# Altium schematic sheet Sheet2.SchDoc
size A4
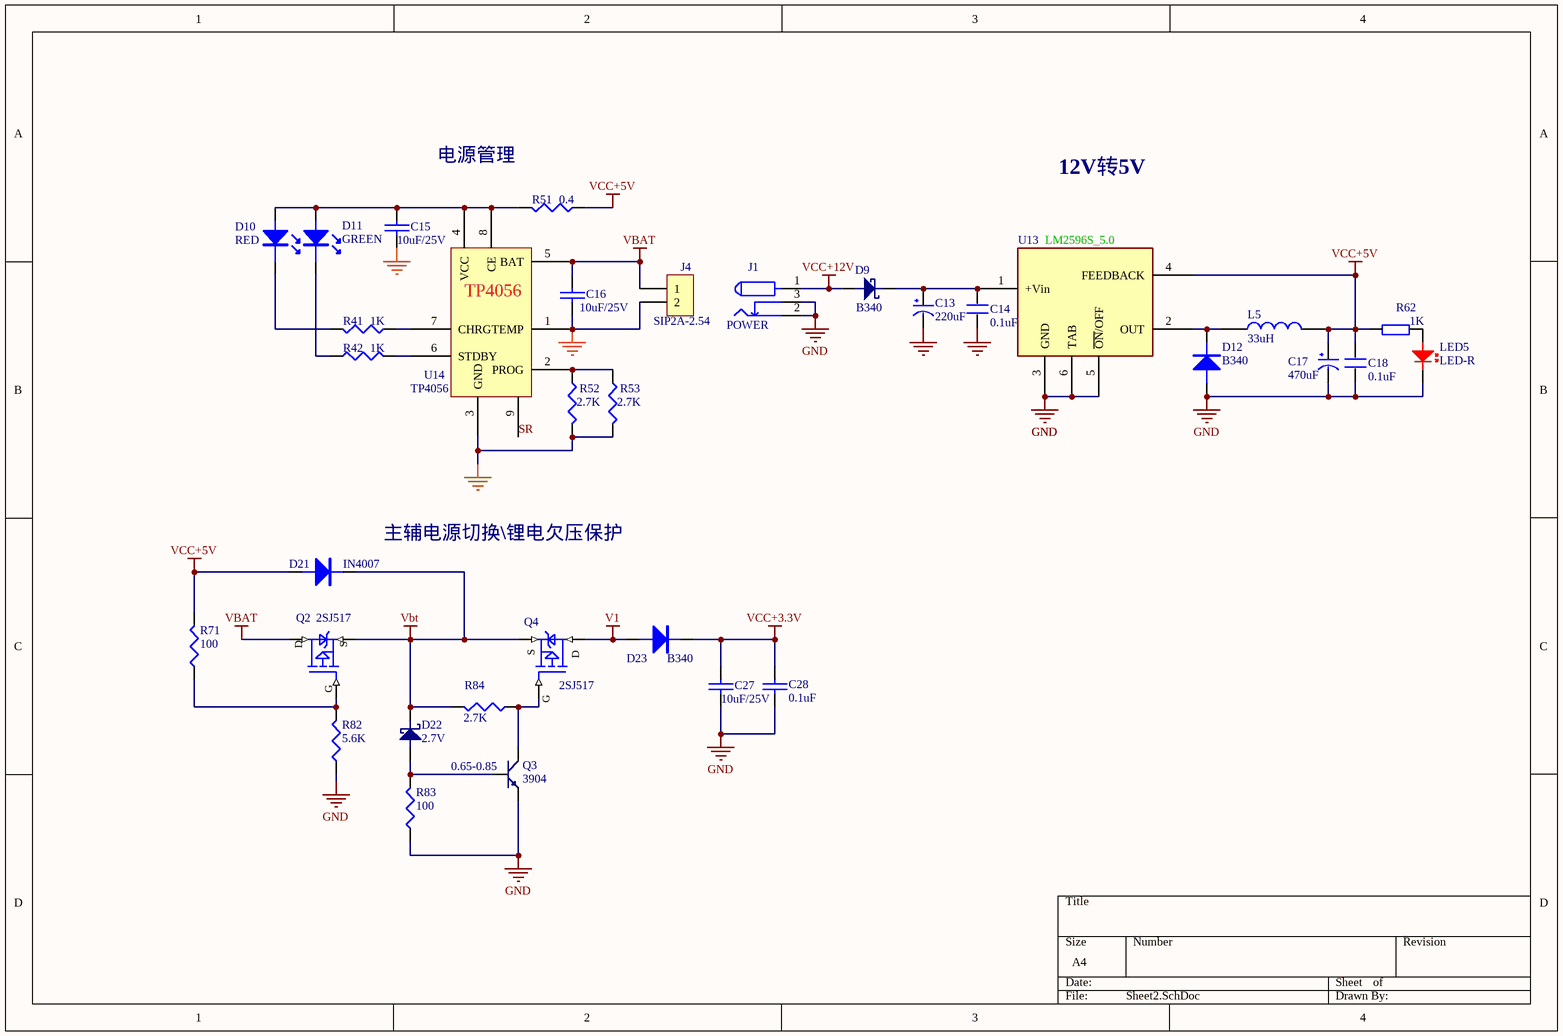
[diagram p0: Sheet2.SchDoc]

## Parts
C13  220uF  [RB3.5]
C14  0.1uF  [0805]
C15  10uF/25V  [0805]
C16  10uF/25V  [0805]
C17  470uF  [RB3.5]
C18  0.1uF  [0805]
C27  10uF/25V  [0805]
C28  0.1uF  [0805]
D9  B340  [SMB]
D10  RED  [LED-0805]
D11  GREEN  [LED-0805]
D12  B340  [SMB]
D21  IN4007  [SMA(DO-214AC)]
D22  2.7V  [sod-123]
D23  B340  [SMB]
J1  POWER  [DC10B]
J4  SIP2A-2.54  [2.54]
L5  33uH  [INDUCTOR-1212]
LED5  LED-R  [LED-0805]
Q2  2SJ517  [SOT-89]
Q3  3904  [SOT-23]
Q4  2SJ517  [SOT-89]
R41  1K  [0805]
R42  1K  [0805]
R51  0.4  [1206]
R52  2.7K  [0805]
R53  2.7K  [0805]
R62  1K  [0805]
R71  100  [0805]
R82  5.6K  [0805]
R83  100  [0805]
R84  2.7K  [0805]
U13  LM2596S_5.0  [TO-263-5]
U14  TP4056  [SO8E]

## Nets
GND: C13.2(GND) C14.1 C15.2 C16.2 C17.2(GND) C18.1 C27.2 C28.2 D12.1(A) J1.2 J1.3 J4.2 LED5.2 Q3.1(E) R52.2 R53.2 R82.1 R83.1 U13.3(GND) U13.5(~{ON}/OFF) U13.6(TAB) U14.1(TEMP) U14.3(GND)
V1: D23.1(A) Q4.2(D)
VBAT: C16.1 J4.1 Q2.2(D) U14.5(BAT)
Vbt: D21.2(K) D22.2 Q2.3(S) Q4.3(S) R84.2
VCC+3.3V: C27.1 C28.1 D23.2(K)
VCC+5V: C17.1(VCC) C18.2 D21.1(A) L5.2 R51.1 R62.1 R71.2 U13.4(FEEDBACK)
VCC+12V: D9.1 J1.1
SR: U14.9
NetC13_1: C13.1(VCC) C14.2 D9.2 U13.1(+Vin)
NetC15_1: C15.1 D10.1 D11.1 R51.2 U14.4(VCC) U14.8(CE)
NetD10_2: D10.2 R41.2
NetD11_2: D11.2 R42.1
NetD12_2: D12.2(K) L5.1 U13.2(OUT)
NetD22_1: D22.1 Q3.2(B) R83.2
NetLED5_1: LED5.1 R62.2
NetQ2_1: Q2.1(G) R71.1 R82.2
NetQ3_3: Q3.3(C) Q4.1(G) R84.1
NetR41_1: R41.1 U14.7(CHRG)
NetR42_2: R42.2 U14.6(STDBY)
NetR52_1: R52.1 R53.1 U14.2(PROG)

## Notes on the sheet
- 电源管理
- 12V转5V
- (near D21) 主辅电源切换\锂电欠压保护
- (near Q3) 0.65-0.85

## Library data of the parts
C13 C15-C17 C27 C28 = CAP
C14 C18 = C
D9 = 1N5824(SS54): 肖特基二极管
D10 D11 = LED
D12 D21 D23 = DIODE
D22 = 1N5824(SS54): 3V稳压管
J1 = POW
J4 = SIP2A-2.50（带槽）
L5 = INDUCTOR
LED5 = LED-RED: 红色LED
Q2 Q4 = MOSFET P_1
Q3 = NPN: 8050/BCW846/BCW847
R41 R42 R51-R53 = RES1
R62 = Res
R71 R82-R84 = RESISTOR
U13 = LM2596S_5.0: 3A开关电源芯片